# EasyEDA Pro project AS5600无刷电机磁编码器板(兼容 2804_4010无刷电机).epro

# Schematic sch_01
Create Date: 2023-08-28; Page Name: P1; Project Name: 2804电机磁编码器板; Schematic Name: sch_01; Update Date: 2023-08-30; Company: 嘉立创EDA; Page Size: A3; Version: V1.0
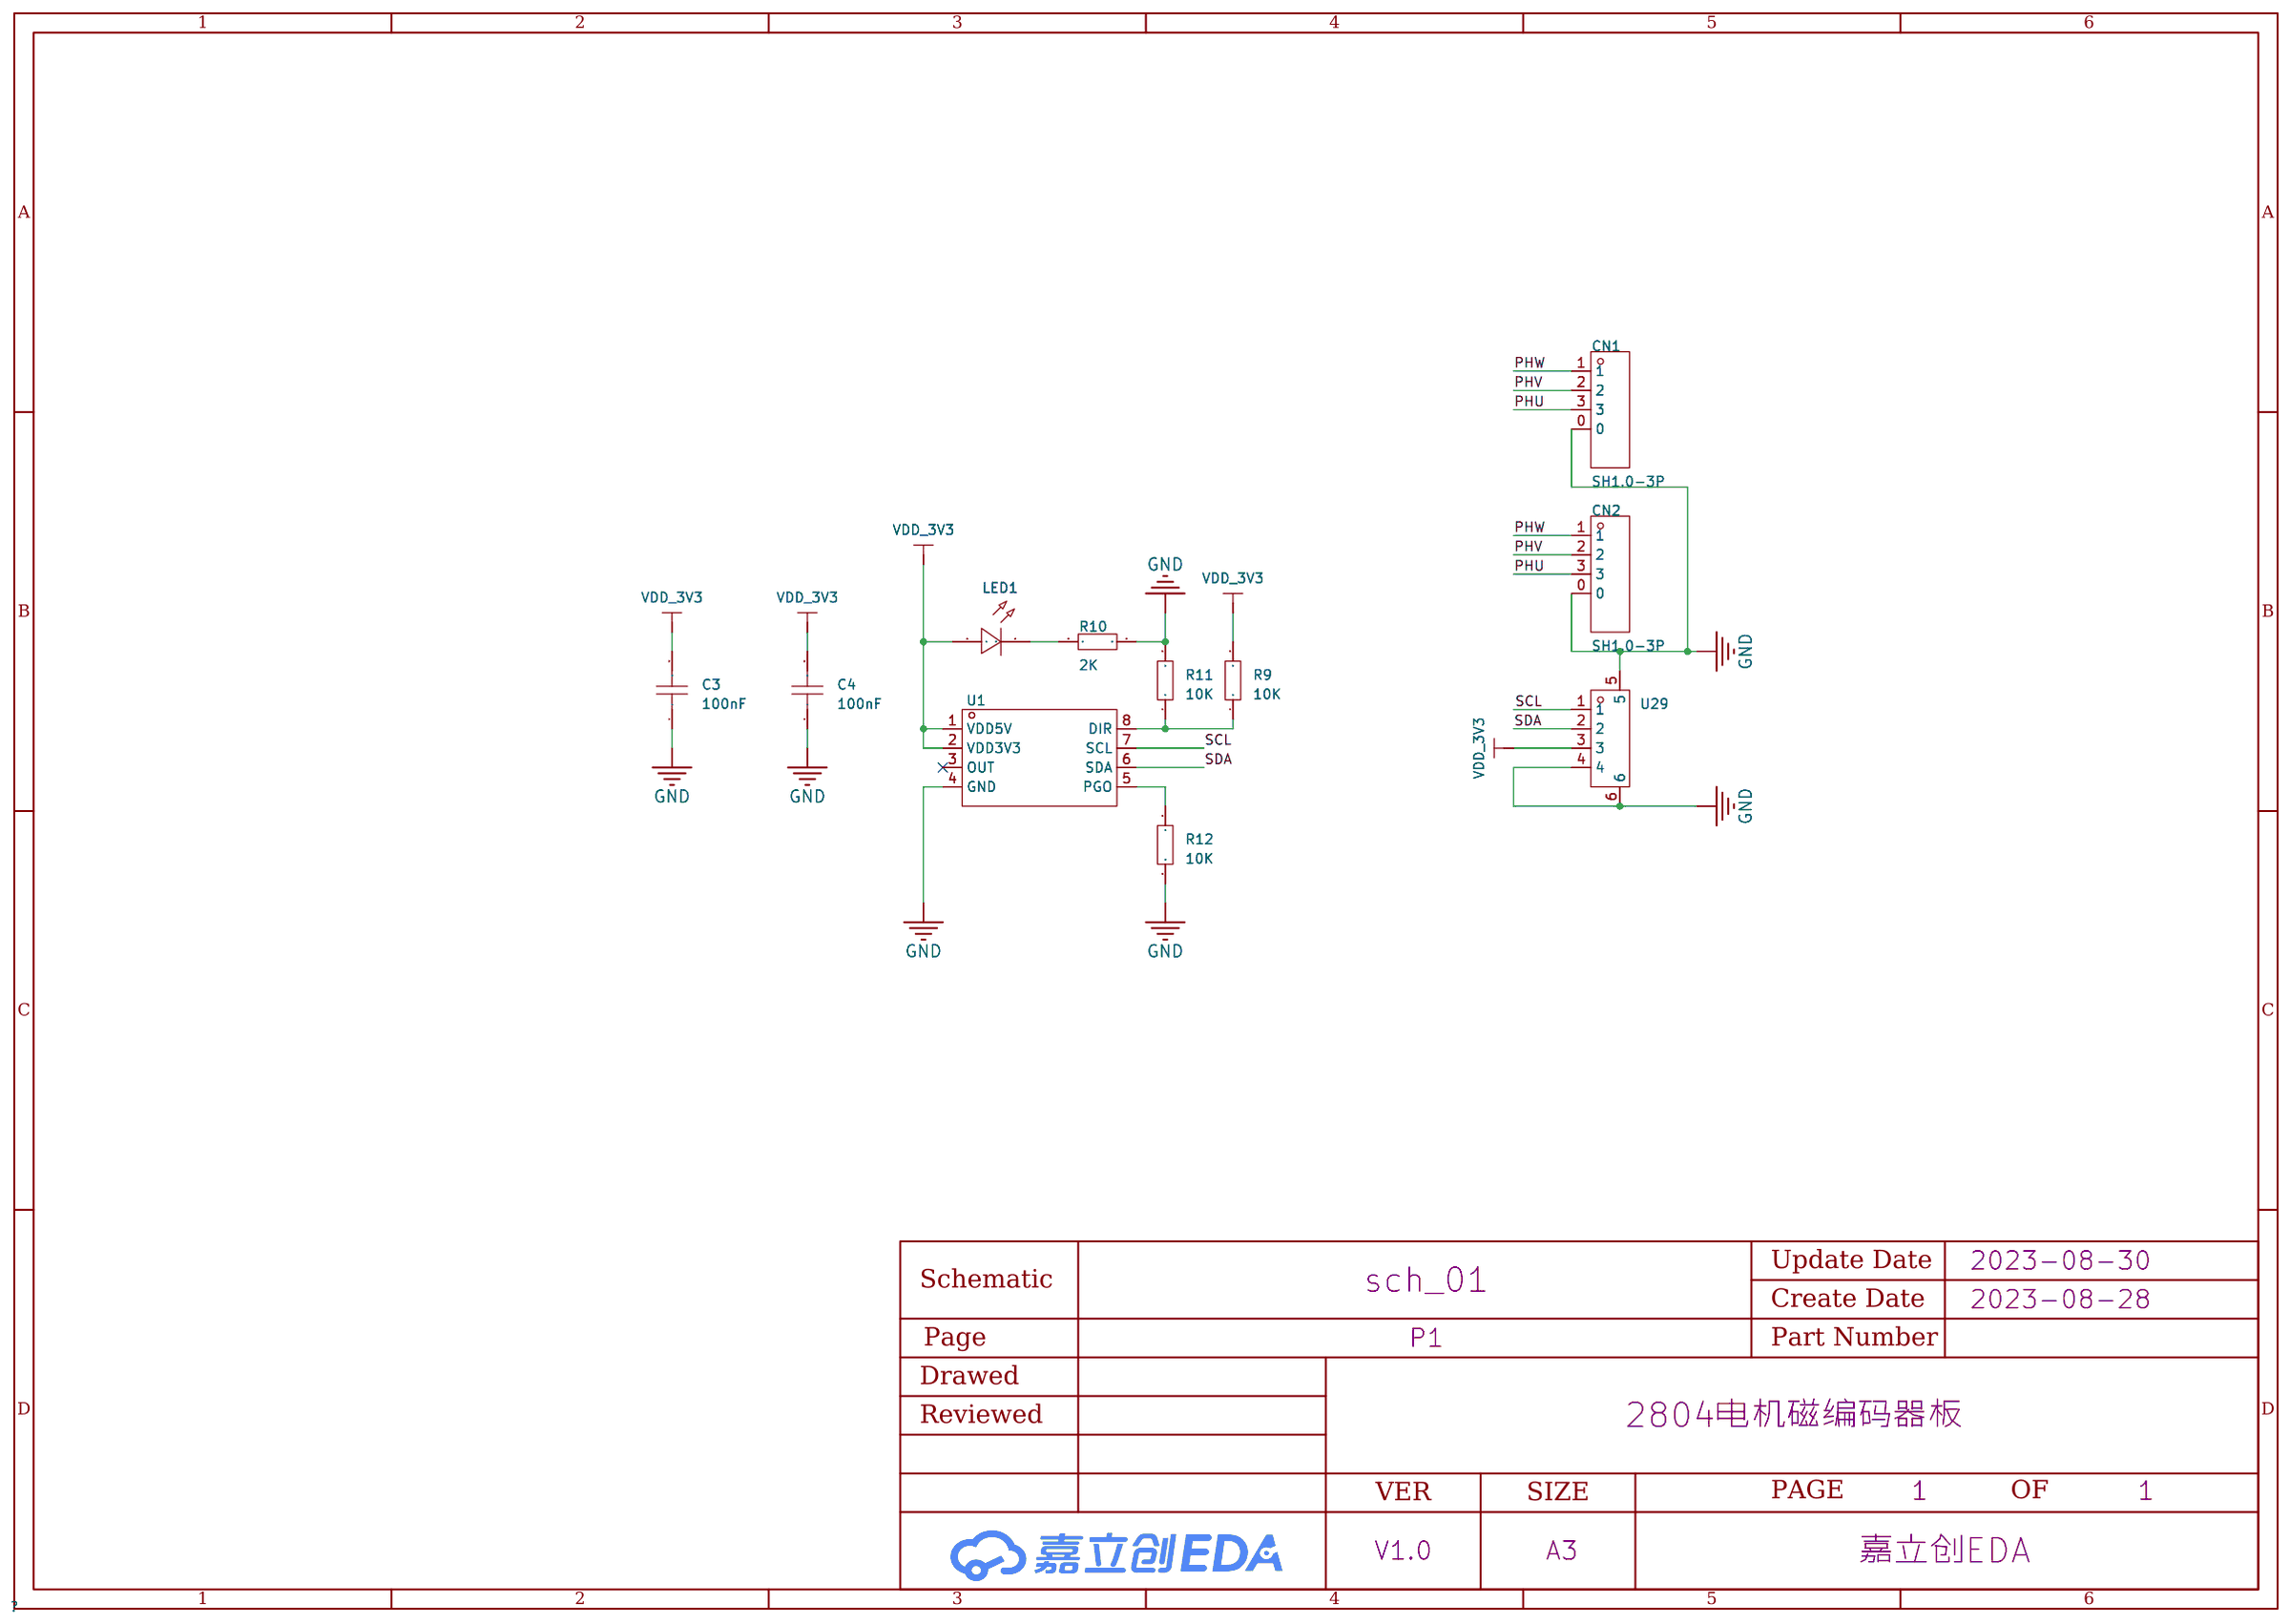
[diagram p0: schematic sheet]

## Parts
C3  100nF  [C0603]
C4  100nF  [C0603]
CN1  SH1.0-3P  [CONN-SMD_3P-P1.00-L5.0-W5.0]
CN2  SH1.0-3P  [CONN-SMD_3P-P1.00-L5.0-W5.0]
LED1  -  [LED_0603]
R9  10K  [R0603]
R10  2K  [R0603]
R11  10K  [R0603]
R12  10K  [R0603]
U1  AS5600-ASOM  [SOIC-8_L5.0-W4.0-P1.27-LS6.0-BL]
U29  SH1.0-4P  [CONN-SMD_4P-P1.00_SH1.0-4P]

## Library data of the parts
C3 C4 = CAP_0603: Supplier Footprint: 0603
CN1 CN2 = SH1.0-3P: Supplier Part: C9900019066; JLCPCB Part Class: 扩展库; Datasheet: https://atta.szlcsc.comnull; Supplier: LCSC
LED1 = LED_0603-G: Supplier Footprint: 0603
R9-R12 = Res_0603: Supplier Footprint: 0603
U1 = AS5600-ASOM: 非接触12bit磁角度位置传感器; Supplier Part: C79815; Manufacturer: ams(艾迈斯半导体); Supplier Footprint: SOIC-8_150mil; JLCPCB Part Class: 扩展库; Datasheet: https://atta.szlcsc.com/upload/public/pdf/source/20161027/1477535527192.pdf; Supplier: LCSC
U29 = SH1.0-4P: Supplier Part: C9900023784; Supplier Footprint: CONN-SMD-4P; JLCPCB Part Class: 扩展库; Supplier: LCSC

## Nets
GND: C3.1 C4.1 CN1.0 CN2.0 R10.1 R11.2 R12.2 U1.4(GND) U29.4 U29.5 U29.6
VDD_3V3: C3.2 C4.2 LED1.2(A) R9.2 U1.1(VDD5V) U1.2(VDD3V3) U29.3
PHU: CN1.3 CN2.3
PHV: CN1.2 CN2.2
PHW: CN1.1 CN2.1
SCL: U1.7(SCL) U29.1
SDA: U1.6(SDA) U29.2
$1N1460: R12.1 U1.5(PGO)
$1N3909: R9.1 R11.1 U1.8(DIR)
Net-(LED1-1): LED1.1(C) R10.2

Not connected (* = marked no-connect by the designer): U1 3(OUT)*

# Schematic sch_02
Create Date: 2023-02-28; Page Name: P1; Project Name: 2804电机磁编码器板; Schematic Name: SCH_02; Update Date: 2023-02-28; Company: 嘉立创EDA; Page Size: A4; Version: V1.0
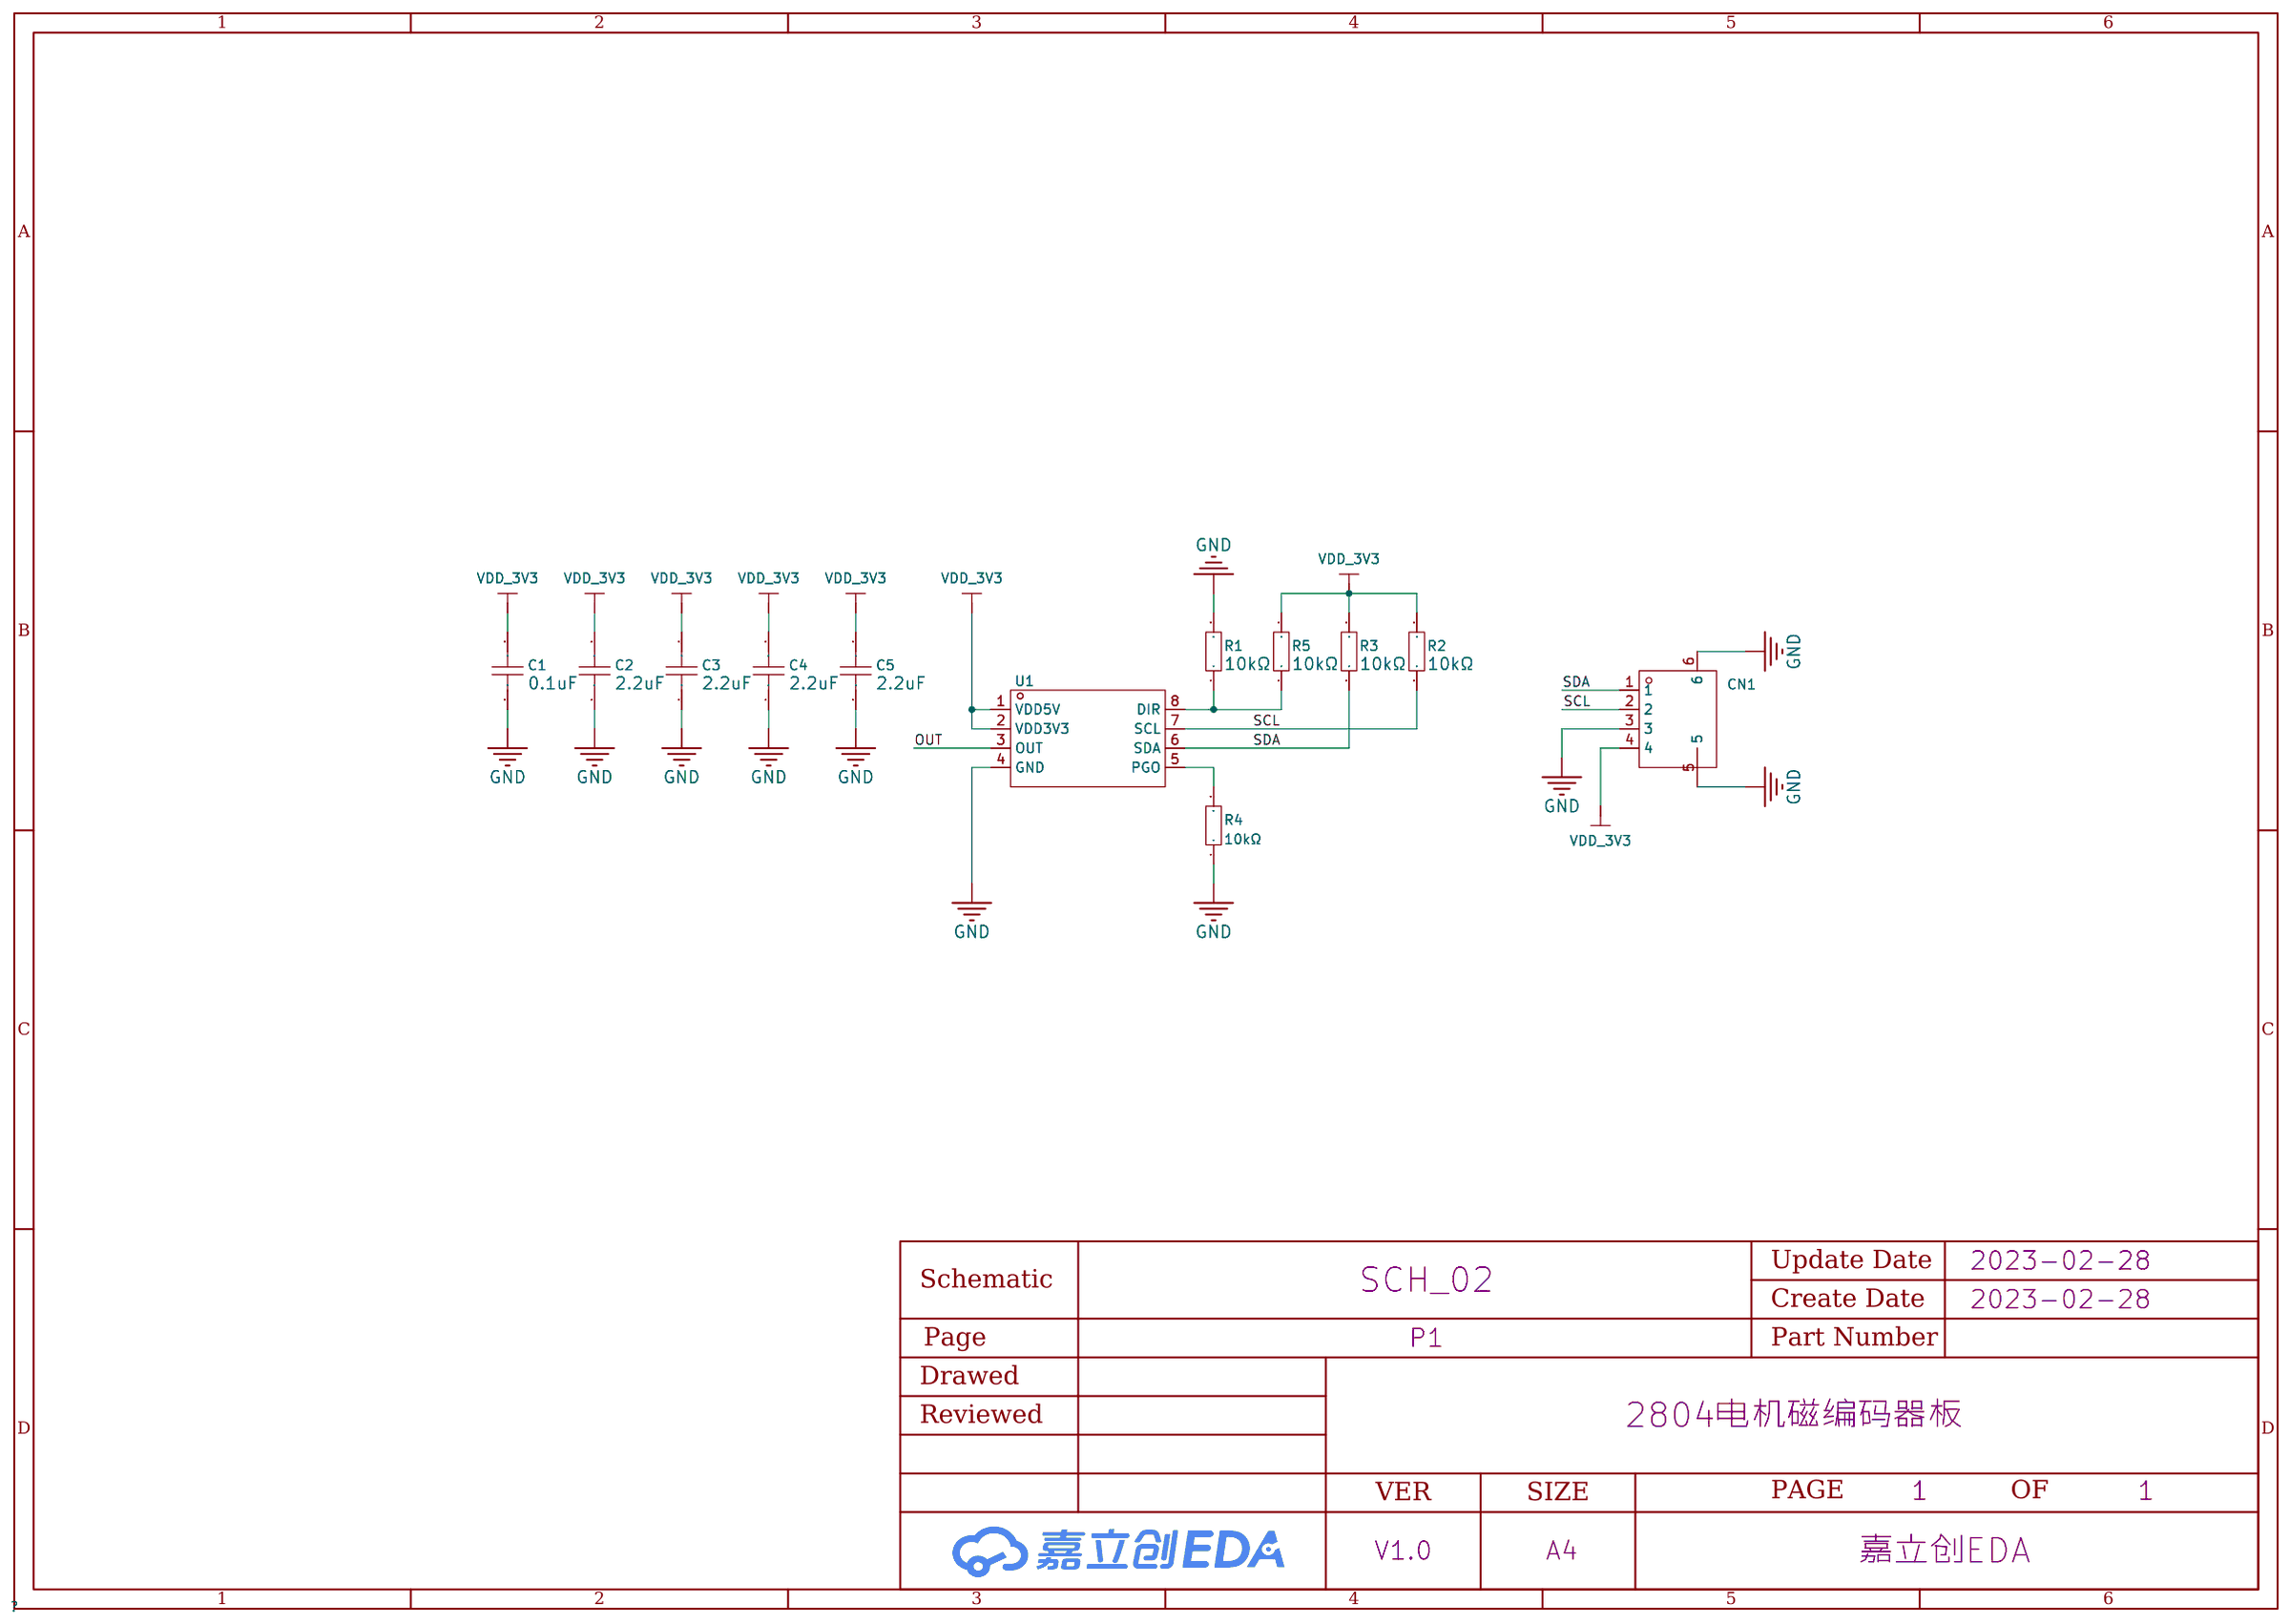
[diagram p1: schematic sheet]

## Parts
C1  0.1uF  [C0603]
C2  2.2uF  [C0603]
C3  2.2uF  [C0603]
C4  2.2uF  [C0603]
C5  2.2uF  [C0603]
CN1  A1257WR-S-4P  [CONN-SMD_A1257WR-S-4P]
R1  10kΩ  [R0603]
R2  10kΩ  [R0603]
R3  10kΩ  [R0603]
R4  10kΩ  [R0603]
R5  10kΩ  [R0603]
U1  AS5600-ASOM  [SOIC-8_L5.0-W4.0-P1.27-LS6.0-BL]

## Library data of the parts
C1 = CL10B104KB8NNNC: 容值:100nF;精度:±10%;额定电压:50V;材质(温度系数):X7R;; LCSC Part Name: 100nF ±10% 50V; Supplier Part: C1591; Manufacturer: SAMSUNG(三星); Supplier Footprint: 0603; JLCPCB Part Class: 扩展库; Datasheet: https://atta.szlcsc.com/upload/public/pdf/source/20160103/1457707680512.pdf; Supplier: LCSC; Tolerance: ±10%; Voltage Rated: 50V; Temperature Coefficient: X7R
C2-C5 = CL10A106MA8NRNC: 容值:10uF;精度:±20%;额定电压:25V;材质(温度系数):X5R;; LCSC Part Name: 10uF ±20% 25V; Supplier Part: C96446; Manufacturer: SAMSUNG(三星); Supplier Footprint: 0603; JLCPCB Part Class: 基础库; Datasheet: https://atta.szlcsc.com/upload/public/pdf/source/20170325/1490427913016.pdf; Supplier: LCSC; Tolerance: ±20%; Voltage Rated: 25V; Temperature Coefficient: X5R
CN1 = A1257WR-S-4P: 参考系列:GH;间距:1.25mm;插针结构:1x4P;排数:1;每排PIN数:4;行距:-;安装方式:-;触头材质:黄铜;; LCSC Part Name: GH1.25卧式贴片 镀锡 4P 针座连接器; Supplier Part: C225127; Manufacturer: CJT(长江连接器); Supplier Footprint: SMD,P=1.25mm; JLCPCB Part Class: Extended Part; Datasheet: https://atta.szlcsc.com/upload/public/pdf/source/20180509/C225127_D8D3C7F8F1F45F960D198B1E232900BE.pdf; Supplier: LCSC; Reference Series: GH; Pitch: 1.25mm; Pins Structure: 1x4P; Number of Rows: 1; Number of PINs Per Row: 4; Contact Material: 黄铜
R1-R3 R5 = 0603WAF1002T5E: 电阻类型:厚膜电阻;阻值:10kΩ;精度:±1%;功率:100mW;温度系数:±100ppm/;最大工作电压:75V;工作温度范围:-55~+155;; LCSC Part Name: 10kΩ ±1% 100mW; Supplier Part: C25804; Manufacturer: UNI-ROYAL(厚声); Supplier Footprint: 0603; JLCPCB Part Class: 基础库; Datasheet: https://atta.szlcsc.com/upload/public/pdf/source/20200306/C422600_1E6D84923E4A46A82E41ADD87F860B5C.pdf; Supplier: LCSC; Type: 厚膜电阻; Tolerance: ±1%; Power(Watts): 100mW; Temperature Coefficient: ±100ppm/; Overload Voltage (Max): 75V; Operating Temperature Range: -55~+155
R4 = 0603WAF1001T5E: LCSC Part Name: 1KΩ(1001) ±1% 编带; Supplier Part: C21190; Manufacturer: UNI-ROYAL(厚声); Supplier Footprint: 0603; JLCPCB Part Class: 基础库; Datasheet: https://atta.szlcsc.com/upload/public/pdf/source/20170920/C21190_1505887441885980538.pdf; Supplier: LCSC
U1 = AS5600-ASOM: 非接触12bit磁角度位置传感器; Supplier Part: C79815; Manufacturer: ams(艾迈斯半导体); Supplier Footprint: SOIC-8_150mil; JLCPCB Part Class: 扩展库; Datasheet: https://atta.szlcsc.com/upload/public/pdf/source/20161027/1477535527192.pdf; Supplier: LCSC

## Nets
GND: C1.1 C2.1 C3.1 C4.1 C5.1 CN1.3 CN1.5 CN1.6 R1.2 R4.1 U1.4(GND)
VDD_3V3: C1.2 C2.2 C3.2 C4.2 C5.2 CN1.4 R2.2 R3.2 R5.2 U1.1(VDD5V) U1.2(VDD3V3)
OUT: U1.3(OUT)
SCL: CN1.2 R2.1 U1.7(SCL)
SDA: CN1.1 R3.1 U1.6(SDA)
$1N622: R1.1 R5.1 U1.8(DIR)
$1N626: R4.2 U1.5(PGO)

# Board PCB_01
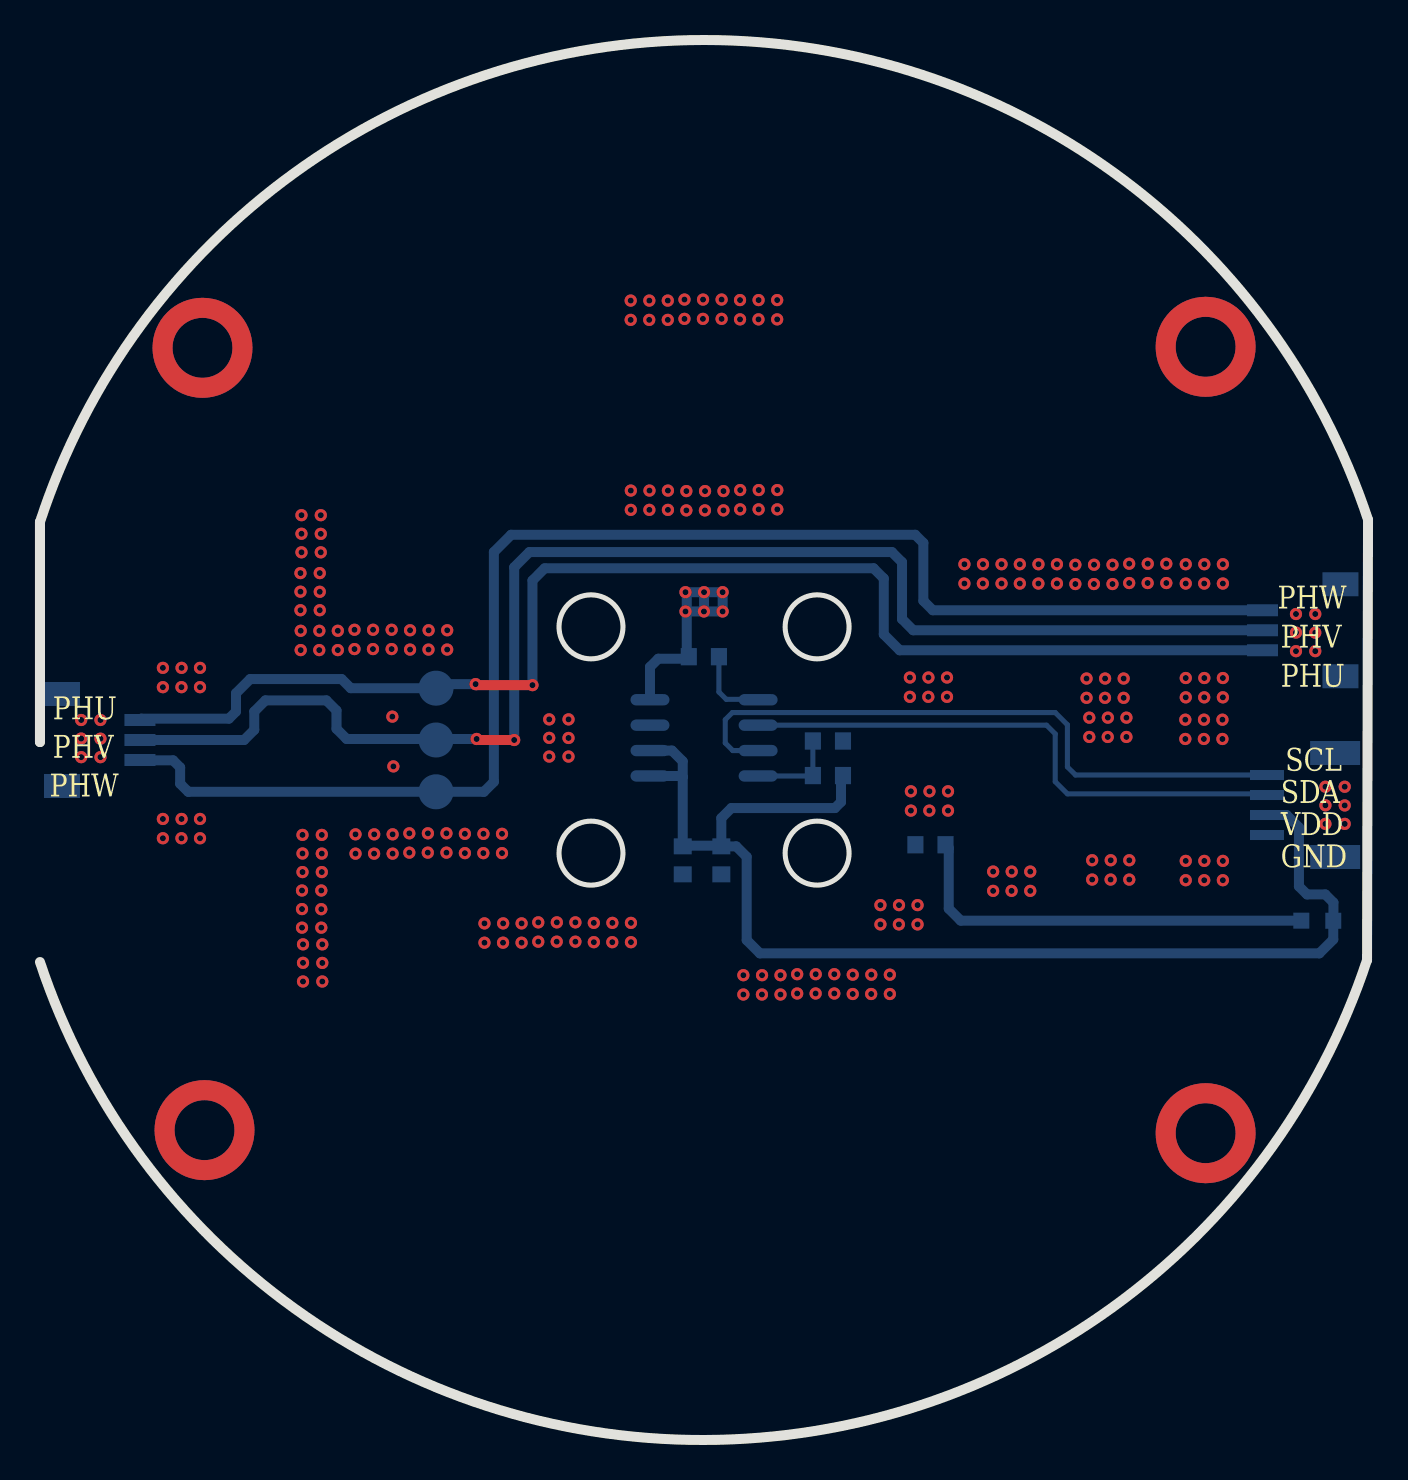
[diagram p2: board, top side]
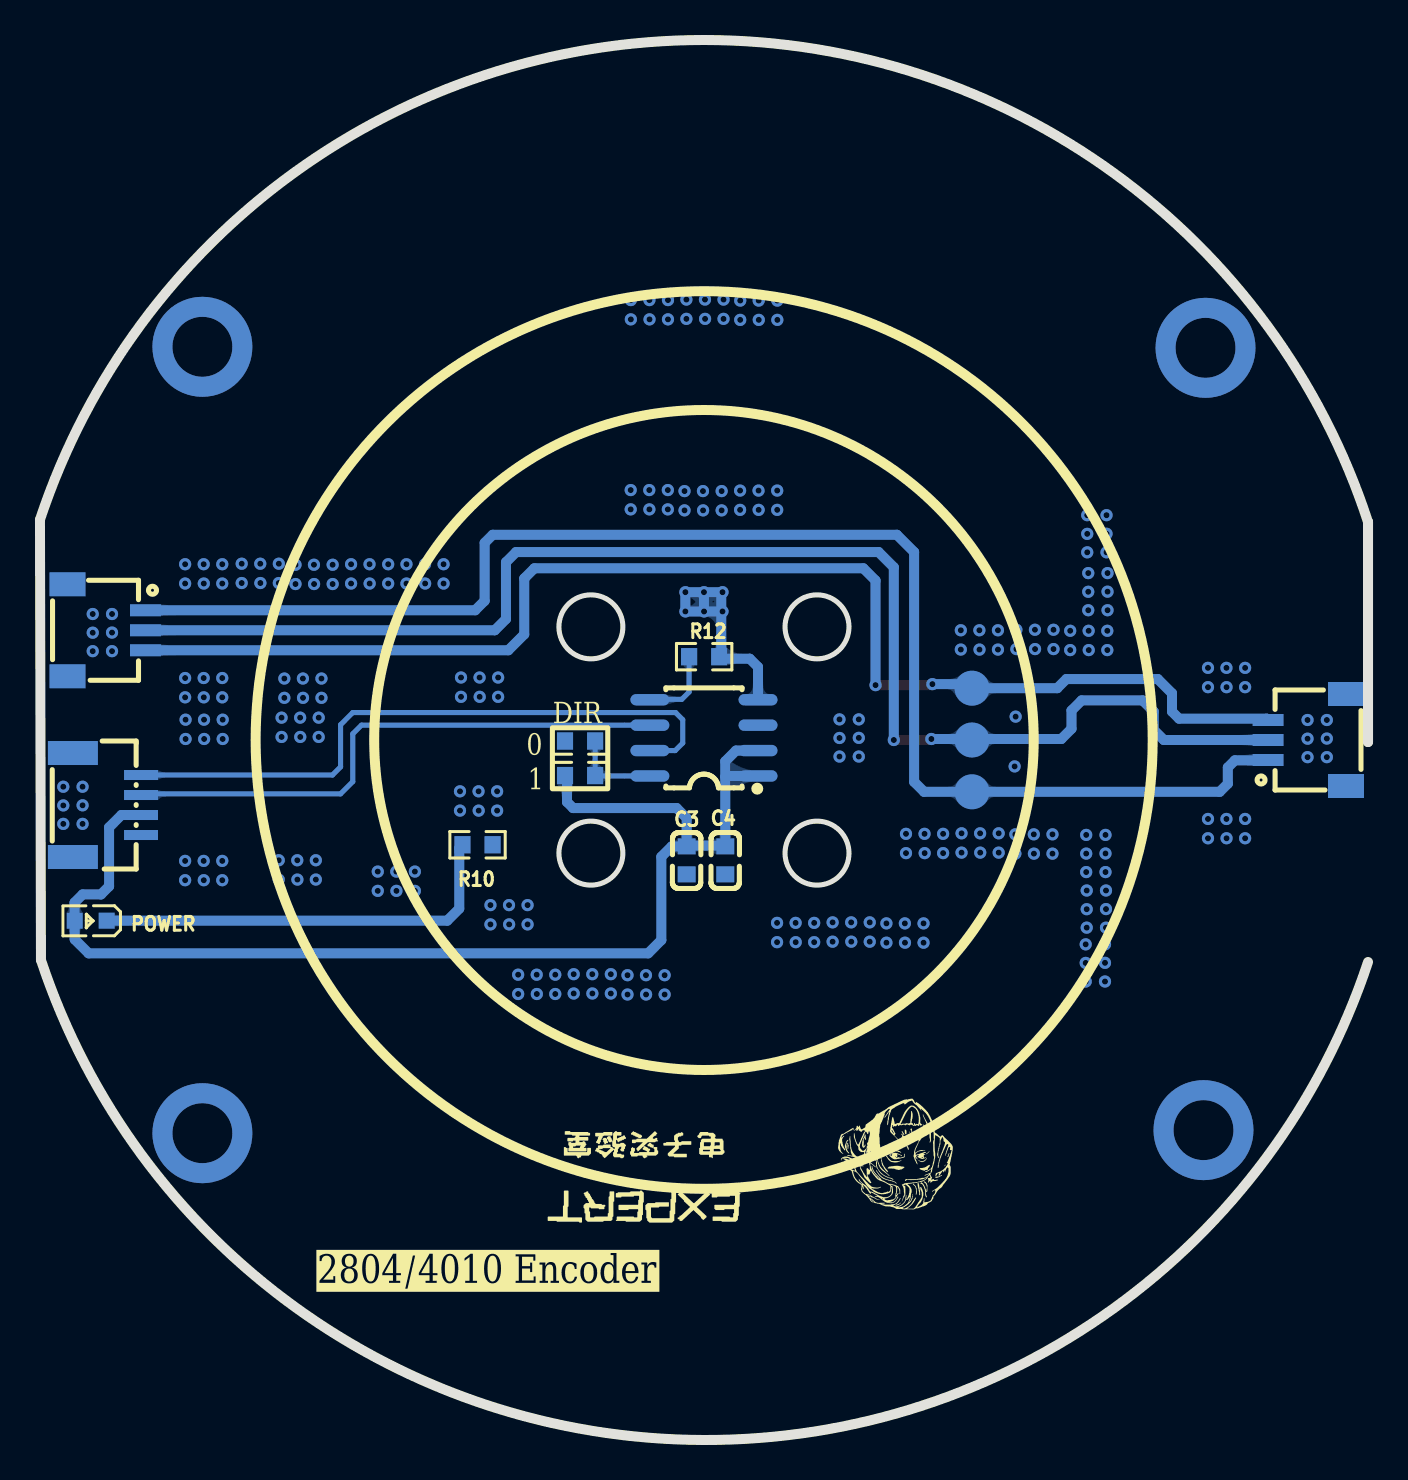
[diagram p3: board, bottom side, seen from below]

Outline 66.45 x 70 mm; copper layers: Top Layer, Bottom Layer. Coordinates in mm from the lower left corner of the outline.
Outline path: circle c27.57,40.66 r1.6 ; circle c27.57,29.34 r1.6 ; circle c38.88,40.66 r1.6 ; circle c38.88,29.34 r1.6 ; 0,45.9 0,34.9 0,45.9 ; 0,45.9 arc(12.71,63.34) 33.23,70 arc(53.71,63.38) 66.45,46.02 66.4,24 arc(53.69,6.65) 33.23,0 arc(12.74,6.57) 0,23.9
Stack: Top Layer 0.035mm / Dielectric1 1.51mm FR4 er 4.5 / Bottom Layer 0.035mm

## Design rules (mm)
template: 用户自定义配置
spacing safeClearance (default): track to track 0.152, other pairs 0 to 0.3
track width trackWidth (default): min 0.127, default 0.254, max 2.54
differential pair differentialPair (default): width min 0.127, default 0.254, max 2.54; gap min 0.152, default 0.152
via viaSize (default): diameter min 0.5, default 0.61, max 10; hole min 0.3, default 0.305, max 5.999

## Placement (name value [footprint] x y rotation side)
C3  100nF  [C0603]  34.09 28.98 90 bottom
C4  100nF  [C0603]  32.16 28.98 90 bottom
CN1  SH1.0-3P  [CONN-SMD_3P-P1.00-L5.0-W5.0]  63.12 40.49 270 bottom
CN2  SH1.0-3P  [CONN-SMD_3P-P1.00-L5.0-W5.0]  3.05 35 90 bottom
NOREF  -  [Pad_e1105]  19.82 37.59 180 top
NOREF#2  -  [Pad_e1112]  19.82 35 180 top
NOREF#3  -  [Pad_e1113]  19.82 32.41 180 top
POWER  -  [LED_0603]  63.96 25.96 0 bottom
R9  10K  [R0603]  39.42 33.22 0 bottom
R10  2K  [R0603]  44.56 29.76 0 bottom
R11  10K  [R0603]  39.42 34.95 0 bottom
R12  10K  [R0603]  33.22 39.17 180 bottom
U1  AS5600-ASOM  [SOIC-8_L5.0-W4.0-P1.27-LS6.0-BL]  33.23 35.11 90 bottom
U29  SH1.0-4P  [CONN-SMD_4P-P1.00_SH1.0-4P]  63.1 31.75 270 bottom

## Footprints (pads in the part's own frame, mm; a bottom-side part is the same pattern mirrored in y, then rotated)
C0603
  rect 0.8x0.9 smd: 1(-0.7,0) 2(0.7,0)
CONN-SMD_3P-P1.00-L5.0-W5.0
  rect 1.2x1.8 smd: 0(-2.3,-1.95) 0(2.3,-1.95)
  rect 0.6x1.55 smd: 1(-1,1.95) 2(0,1.95) 3(1,1.95)
CONN-SMD_4P-P1.00_SH1.0-4P
  rect 0.5x1.7 smd: 1(-1.5,1.705) 2(-0.5,1.705) 3(0.5,1.705) 4(1.5,1.705)
  rect 1.2x2.5 smd: 5(-2.6,-1.705) 6(2.6,-1.705)
LED_0603
  rect 0.8x0.8 smd: 1(-0.851,-0.01) 2(0.75,-0.005)
Pad_e1105
  round 1.75 smd far side: 1(0,0)
Pad_e1112
  round 1.75 smd far side: 1(0,0)
Pad_e1113
  round 1.75 smd far side: 1(0,0)
R0603
  rect 0.806x0.864 smd: 1(-0.753,0) 2(0.753,0)
SOIC-8_L5.0-W4.0-P1.27-LS6.0-BL
  oval 0.569x1.95 smd: 1(-1.905,-2.705) 2(-0.635,-2.705) 3(0.635,-2.705) 4(1.905,-2.705) 5(1.905,2.705) 6(0.635,2.705) 7(-0.635,2.705) 8(-1.905,2.705)

## Nets
GND: C3.1 C4.1 CN1.0 CN2.0 R10.1 R11.2 R12.2 U1.4 U29.4 U29.5 U29.6
VDD_3V3: C3.2 C4.2 POWER.2 R9.2 U1.1 U1.2 U29.3
PHU: CN1.3 CN2.3 NOREF.1
PHV: CN1.2 CN2.2 NOREF#2.1
PHW: CN1.1 CN2.1 NOREF#3.1
SCL: U1.7 U29.1
SDA: U1.6 U29.2
$1N1460: R12.1 U1.5
$1N3909: R9.1 R11.1 U1.8
$1N7213: POWER.1 R10.2

Pads without a net: U1 3

## Via types
v1: diameter 5, hole 3, Top Layer to Bottom Layer, 4 vias
v2: diameter 0.61, hole 0.305, Top Layer to Bottom Layer, 276 vias

## Routing (per net, layer and track width the routed paths; a pad name or vN(x,y) marks a point on that pad's centre or on a via; arc(x,y) is an arc through that point)
GND: length 12.8
  Bottom Layer w0.5: 32.36,39.06 30.94,39.06 30.52,38.65 U1.4 ; 32.36,39.06 R12.2 ; 32.36,39.06 32.36,41.43 ; v2(33.23,42.39) v2(32.3,42.39) 32.36,42.33 32.36,41.43 ; v2(33.23,42.39) 33.23,41.43 v2(33.22,41.43) ; v2(33.23,42.39) v2(34.16,42.39) v2(34.16,41.43) v2(33.22,41.43) ; v2(33.22,41.43) 32.36,41.43 ; 32.36,41.43 v2(32.3,41.43)
  vias: v2(2.06,36) v2(2.06,35.07) v2(2.06,34.14) v2(3.03,36) v2(3.03,35.07) v2(3.03,34.14) v2(6.15,38.61) v2(6.15,37.64) v2(6.15,31.05) v2(6.15,30.09) v2(7.08,38.61) v2(7.08,37.64) v2(7.08,31.05) v2(7.08,30.09) v2(8.01,38.61) v2(8.01,37.64) v2(8.01,31.05) v2(8.01,30.09) v2(13.03,43.35) v2(13.03,42.42) v2(13.03,41.49) v2(13.05,40.46) v2(13.05,39.5) v2(13.08,46.24) v2(13.08,45.31) v2(13.08,44.38) v2(13.14,30.25) v2(13.14,29.33) v2(13.14,28.4) v2(13.11,27.47) v2(13.11,26.55) v2(13.11,25.62) v2(13.16,24.78) v2(13.16,23.86) v2(13.16,22.92) v2(14.05,46.24) v2(14.05,45.31) v2(14.05,44.38) v2(14,43.35) v2(14,42.41) v2(14,41.49) v2(13.98,40.46) v2(13.97,39.5) v2(14.1,30.25) v2(14.1,29.32) v2(14.1,28.4) v2(14.08,27.47) v2(14.08,26.54) v2(14.08,25.62) v2(14.13,24.78) v2(14.13,23.85) v2(14.13,22.92) v2(14.9,40.46) v2(14.9,39.5) v2(15.74,40.51) v2(15.74,39.55) v2(15.79,30.28) v2(15.79,29.32) v2(16.67,40.51) v2(16.66,39.55) v2(16.72,30.28) v2(16.72,29.32) v2(17.59,40.51) v2(17.59,39.55) v2(17.63,36.17) v2(17.65,30.28) v2(17.65,29.32) v2(17.68,33.68) v2(18.52,40.49) v2(18.52,39.52) v2(18.48,30.33) v2(18.48,29.37) v2(19.45,40.49) v2(19.44,39.52) v2(19.41,30.33) v2(19.4,29.37) v2(20.34,30.33) v2(20.34,29.37) v2(20.37,40.49) v2(20.37,39.52) v2(21.26,30.31) v2(21.26,29.34) v2(22.19,30.31) v2(22.18,29.34) v2(22.24,25.83) v2(22.24,24.87) v2(23.12,30.31) v2(23.12,29.34) v2(23.17,24.87) v2(23.17,25.83) v2(24.1,25.83) v2(24.1,24.87) v2(24.93,25.88) v2(24.93,24.92) v2(25.48,36.03) v2(25.48,35.11) v2(25.48,34.17) v2(25.86,25.88) v2(25.85,24.92) v2(26.44,36.03) v2(26.44,35.1) v2(26.44,34.17) v2(26.79,25.88) v2(26.79,24.92) v2(27.71,25.86) v2(27.71,24.89) v2(28.64,25.86) v2(28.63,24.89) v2(29.56,56.97) v2(29.56,56.01) v2(29.56,47.47) v2(29.56,46.51) v2(29.57,25.86) v2(29.57,24.89) v2(30.49,56.97) v2(30.48,56.01) v2(30.5,47.47) v2(30.49,46.51) v2(31.41,56.97) v2(31.41,56.01) v2(31.42,47.47) v2(31.42,46.51) v2(32.25,57.02) v2(32.25,56.06) v2(32.34,47.45) v2(32.34,46.48) v2(33.17,56.06) v2(33.18,57.02) v2(33.27,46.48) v2(33.28,47.45) v2(34.1,57.02) v2(34.1,56.06) v2(34.2,47.45) v2(34.2,46.48) v2(35.03,57) v2(35.03,56.03) v2(35.03,47.5) v2(35.03,46.53) v2(35.19,23.24) v2(35.19,22.27) v2(35.96,57) v2(35.95,56.03) v2(35.96,47.5) v2(35.96,46.53) v2(36.13,23.24) v2(36.12,22.27) v2(36.88,57) v2(36.88,56.03) v2(36.89,47.5) v2(36.89,46.53) v2(37.05,23.24) v2(37.05,22.27) v2(37.89,23.29) v2(37.89,22.33) v2(38.81,23.29) v2(38.81,22.33) v2(39.74,23.29) v2(39.74,22.33) v2(40.67,23.27) v2(40.67,22.3) v2(41.59,23.27) v2(41.59,22.3) v2(42.05,26.75) v2(42.05,25.78) v2(42.52,23.27) v2(42.52,22.3) v2(42.98,26.75) v2(42.97,25.78) v2(43.53,38.12) v2(43.53,37.16) v2(43.58,32.43) v2(43.58,31.47) v2(43.91,26.75) v2(43.91,25.78) v2(44.45,38.12) v2(44.45,37.16) v2(44.5,32.43) v2(44.5,31.47) v2(45.38,38.12) v2(45.38,37.16) v2(45.43,32.43) v2(45.43,31.47) v2(46.25,43.79) v2(46.25,42.82) v2(47.18,43.79) v2(47.18,42.82) v2(47.69,28.42) v2(47.69,27.46) v2(48.11,43.79) v2(48.11,42.82) v2(48.62,28.42) v2(48.61,27.46) v2(49.03,43.79) v2(49.03,42.82) v2(49.55,28.42) v2(49.55,27.46) v2(49.96,43.79) v2(49.95,42.82) v2(50.88,43.79) v2(50.88,42.82) v2(51.81,43.76) v2(51.81,42.8) v2(52.36,38.07) v2(52.36,37.11) v2(52.5,36.12) v2(52.5,35.15) v2(52.65,28.99) v2(52.65,28.02) v2(52.74,43.76) v2(52.73,42.8) v2(53.29,38.07) v2(53.29,37.11) v2(53.43,36.12) v2(53.43,35.15) v2(53.57,28.02) v2(53.66,43.76) v2(53.66,42.8) v2(53.57,28.99) v2(54.22,38.07) v2(54.22,37.11) v2(54.36,36.12) v2(54.36,35.15) v2(54.5,43.81) v2(54.5,42.85) v2(54.5,28.99) v2(54.5,28.02) v2(55.43,43.81) v2(55.42,42.85) v2(56.35,43.81) v2(56.35,42.85) v2(57.33,43.79) v2(57.33,42.82) v2(57.33,38.1) v2(57.33,37.13) v2(57.31,36.02) v2(57.31,35.05) v2(57.33,28.95) v2(57.33,27.99) v2(58.26,43.79) v2(58.25,42.82) v2(58.26,38.1) v2(58.25,37.13) v2(58.24,36.02) v2(58.23,35.05) v2(58.26,28.95) v2(58.25,27.99) v2(59.16,36.02) v2(59.16,35.05) v2(59.19,43.79) v2(59.19,42.82) v2(59.19,38.1) v2(59.19,37.13) v2(59.19,28.95) v2(59.19,27.99) v2(62.84,41.3) v2(62.84,40.37) v2(62.84,39.44) v2(63.81,41.3) v2(63.81,40.36) v2(63.81,39.44) v2(64.32,32.66) v2(64.32,31.73) v2(64.32,30.81) v2(65.28,32.66) v2(65.28,31.73) v2(65.28,30.81)
VDD_3V3: length 63.1
  Bottom Layer w0.5: 34.09,29.72 C3.2 34.84,29.68 35.36,29.16 35.36,24.99 36.02,24.33 64.01,24.33 64.71,25.03 64.71,25.96 64.72,25.97 64.72,26.87 64.31,27.28 63.4,27.28 62.99,27.69 62.99,30.63 62.37,31.25 U29.3 ; 34.09,29.72 32.2,29.72 C4.2 32.16,33.15 ; 34.09,29.72 34.09,31.09 34.59,31.6 39.77,31.6 40.08,31.9 40.08,33.12 R9.2 ; 32.16,33.15 32.11,33.2 U1.1 ; 32.16,33.15 32.16,33.93 31.62,34.47 U1.2
(no net):
  vias: v1(8.13,54.61) v1(8.23,15.49) v1(58.32,54.66) v1(58.32,15.34)
PHU: length 66.7
  Top Layer w0.5: v2(21.8,37.79) 21.85,37.74 v2(24.64,37.74)
  Bottom Layer w0.5: v2(24.64,37.74) 24.64,42.98 25.25,43.59 41.71,43.59 42.22,43.08 42.22,40.28 43.02,39.49 CN1.3 ; CN2.3 5.07,36.07 9.45,36.07 9.81,36.42 9.81,37.34 10.52,38.05 15.09,38.05 15.55,37.59 NOREF.1 20.02,37.79 v2(21.8,37.79)
PHV: length 71.2
  Top Layer w0.5: v2(21.85,35.05) 21.9,35 v2(23.73,35)
  Bottom Layer w0.5: 19.87,35.05 NOREF#2.1 ; 19.87,35.05 15.34,35.05 14.84,35.56 14.84,36.47 14.33,36.98 11.28,36.98 10.72,36.42 10.72,35.51 10.21,35 CN2.2 ; 19.87,35.05 v2(21.85,35.05) ; v2(23.73,35) 23.73,43.64 24.49,44.4 42.62,44.4 43.13,43.89 43.13,41.05 43.69,40.49 CN1.2
PHW: length 72.6
  Bottom Layer w0.5: CN2.1 5.02,33.98 6.66,33.98 7.01,33.63 7.01,32.82 7.42,32.41 NOREF#3.1 22.21,32.41 22.71,32.91 22.71,44.4 23.57,45.26 43.79,45.26 44.2,44.86 44.2,41.96 44.67,41.49 CN1.1
SCL: length 32.7
  Bottom Layer w0.254: U29.1 51.81,33.25 51.41,33.66 51.41,35.76 50.8,36.37 34.64,36.37 34.29,36.02 34.29,34.85 34.66,34.47 35.93,34.47
SDA: length 28.3
  Bottom Layer w0.254: 35.93,35.74 50.36,35.74 50.8,35.31 50.8,32.92 51.41,32.31 61.33,32.31 U29.2
$1N1460: length 3.9
  Bottom Layer w0.254: 35.93,37.01 35.91,37.03 34.34,37.03 33.97,37.4 R12.1
$1N3909: length 4.5
  Bottom Layer w0.254: 35.93,33.2 38.65,33.2 R9.1 R11.1
$1N7213: length 21.1
  Bottom Layer w0.5: POWER.1 46.07,25.97 45.47,26.57 45.47,29.6 R10.2

## Copper pours and planes (outline as drawn; the poured copper is in the pictures)
GND on Top Layer: -4.27,72.08 69.34,72.08 69.34,-4.12 -4.27,-4.12
GND on Bottom Layer: -5.44,73.66 71.12,73.66 71.12,-5.69 -5.44,-5.69

Small or netless copper shapes (teardrops, artwork), in the pictures only: 43 on Bottom Layer

## Text on the board
Bottom Silkscreen Layer: DIR | 1 | 0 | 2804/4010 Encoder
Top Silkscreen Layer: GND | SDA | VDD | SCL | PHW | PHV | PHU

# Board PCB_02
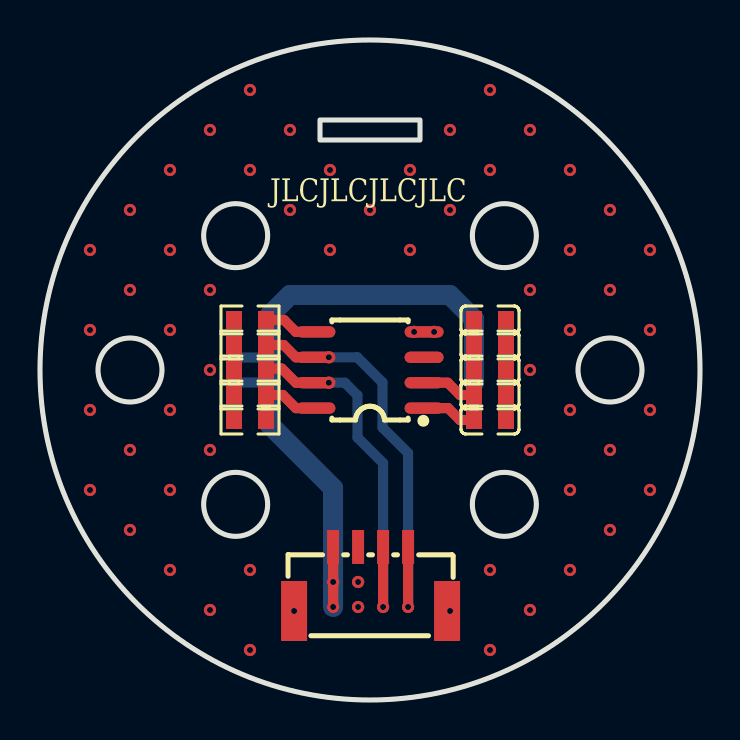
[diagram p4: board, top side]
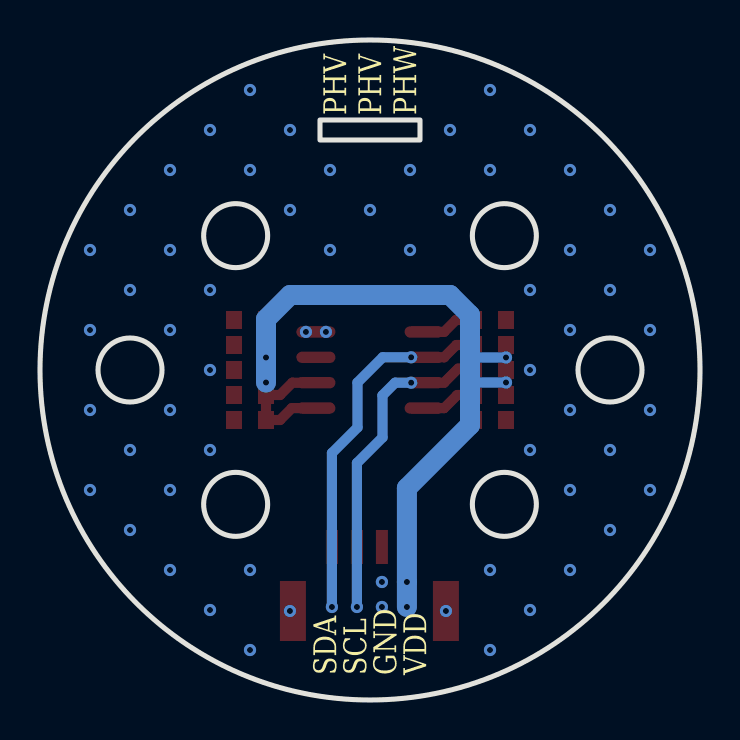
[diagram p5: board, bottom side, seen from below]

Outline 33 x 33 mm; copper layers: Top Layer, Bottom Layer. Coordinates in mm from the lower left corner of the outline.
Outline path: circle c4.5,16.5 r1.6 ; circle c9.78,23.22 r1.6 ; circle c9.78,9.78 r1.6 ; rectangle 14,29 19,28 ; circle c16.5,16.5 r16.5 ; circle c23.22,23.22 r1.6 ; circle c23.22,9.78 r1.6 ; circle c28.5,16.5 r1.6
Stack: Top Layer 0.035mm / Dielectric1 1.51mm FR4 er 4.5 / Bottom Layer 0.035mm

## Design rules (mm)
template: 自定义配置
spacing copperThickness1oz (default): track to track 0.102, other pairs 0 to 0.3
spacing copperThickness2oz: track to track 0.203, other pairs 0.152 to 0.3
track width copperThickness1oz (default): min 0.127, default 0.254, max 2.54
track width copperThickness2oz: min 0.203, default 0.254, max 2.54
differential pair differentialPair (default): width min 0.127, default 0.254, max 2.54; gap min 0.152, default 0.152
via viaSize (default): diameter min 0.5, default 0.61, max 10; hole min 0.3, default 0.305, max 6.3

## Placement (name value [footprint] x y rotation side)
C1  0.1uF  [C0603]  22.5 16.5 180 top
C2  2.2uF  [C0603]  22.5 17.75 180 top
C3  2.2uF  [C0603]  22.5 15.25 180 top
C4  2.2uF  [C0603]  22.5 14 180 top
C5  2.2uF  [C0603]  22.5 19 180 top
CN1  A1257WR-S-4P  [CONN-SMD_A1257WR-S-4P]  16.53 6.05 0 top
R1  10kΩ  [R0603]  10.5 14 180 top
R2  10kΩ  [R0603]  10.5 16.5 180 top
R3  10kΩ  [R0603]  10.5 17.75 180 top
R4  10kΩ  [R0603]  10.5 19 0 top
R5  10kΩ  [R0603]  10.5 15.25 180 top
U1  AS5600-ASOM  [SOIC-8_L5.0-W4.0-P1.27-LS6.0-BL]  16.5 16.5 90 top

## Footprints (pads in the part's own frame, mm; a bottom-side part is the same pattern mirrored in y, then rotated)
C0603
  rect 0.8x0.9 smd: 1(-0.8,0) 2(0.8,0)
CONN-SMD_A1257WR-S-4P
  rect 0.6x1.7 smd: 1(1.875,1.6) 2(0.625,1.6) 3(-0.625,1.6) 4(-1.875,1.6)
  rect 1.3x3 smd: 5(3.825,-1.6) 6(-3.825,-1.6)
R0603
  rect 0.8x0.9 smd: 1(-0.8,0) 2(0.8,0)
SOIC-8_L5.0-W4.0-P1.27-LS6.0-BL
  oval 0.569x1.95 smd: 1(-1.905,-2.705) 2(-0.635,-2.705) 3(0.635,-2.705) 4(1.905,-2.705) 5(1.905,2.705) 6(0.635,2.705) 7(-0.635,2.705) 8(-1.905,2.705)

## Nets
As in the schematic.

## Via types
v1: diameter 0.61, hole 0.305, Top Layer to Bottom Layer, 71 vias

## Routing (per net, layer and track width the routed paths; a pad name or vN(x,y) marks a point on that pad's centre or on a via; arc(x,y) is an arc through that point)
GND:
  vias: v1(2.5,22.5) v1(2.5,18.5) v1(2.5,14.5) v1(2.5,10.5) v1(4.5,24.5) v1(4.5,20.5) v1(4.5,12.5) v1(4.5,8.5) v1(6.5,26.5) v1(6.5,22.5) v1(6.5,18.5) v1(6.5,14.5) v1(6.5,10.5) v1(6.5,6.5) v1(8.5,28.5) v1(8.5,20.5) v1(8.5,16.5) v1(8.5,12.5) v1(8.5,4.5) v1(10.5,30.5) v1(10.5,26.5) v1(10.5,6.5) v1(10.5,2.5) v1(12.5,28.5) v1(12.5,24.5) v1(12.7,4.45) v1(14.5,26.5) v1(14.5,22.5) v1(15.9,5.9) v1(15.9,4.65) v1(16.5,24.5) v1(18.5,26.5) v1(18.5,22.5) v1(18.71,18.41) v1(19.71,18.41) v1(20.5,28.5) v1(20.5,24.5) v1(20.5,4.45) v1(22.5,30.5) v1(22.5,26.5) v1(22.5,6.5) v1(22.5,2.5) v1(24.5,28.5) v1(24.5,20.5) v1(24.5,16.5) v1(24.5,12.5) v1(24.5,4.5) v1(26.5,26.5) v1(26.5,22.5) v1(26.5,18.5) v1(26.5,14.5) v1(26.5,10.5) v1(26.5,6.5) v1(28.5,24.5) v1(28.5,20.5) v1(28.5,12.5) v1(28.5,8.5) v1(30.5,22.5) v1(30.5,18.5) v1(30.5,14.5) v1(30.5,10.5)
VDD_3V3: length 49.8
  Top Layer w0.508: R5.2 v1(9.7,15.88) R2.2 v1(9.7,17.12) R3.2 ; U1.2 20.38,15.86 21,15.25 C3.2 ; v1(14.66,4.65) v1(14.66,5.9) CN1.4 ; C3.2 C4.2 21,14 20.41,14.59 U1.1 ; C3.2 v1(21.7,15.88) C1.2 v1(21.7,17.12) C2.2 C5.2
  Bottom Layer w0.508: v1(9.7,15.88) 11.5,15.88 ; v1(9.7,17.12) 11.5,17.12
  Bottom Layer w1: v1(21.7,15.88) v1(21.7,17.12) 21.7,19.04 20.49,20.25 12.5,20.25 11.5,19.25 11.5,13.75 14.66,10.59 v1(14.66,5.9) v1(14.66,4.65)
SCL: length 18.6
  Top Layer w0.508: CN1.2 v1(17.15,4.65) ; R2.1 11.37,16.57 12.09,16.57 12.79,15.86 U1.7
  Bottom Layer w0.508: v1(14.44,15.86) 15.24,15.86 15.88,15.23 15.88,13.12 17.15,11.85 v1(17.15,4.65)
SDA: length 20.7
  Top Layer w0.508: U1.6 12.79,17.14 12.18,17.75 R3.1 ; CN1.1 v1(18.4,4.65)
  Bottom Layer w0.508: v1(18.4,4.65) 18.4,12.35 17.12,13.62 17.12,15.88 15.87,17.14 v1(14.44,17.14)
$1N622: length 4
  Top Layer w0.508: R1.1 R5.1 12.14,15.25 12.79,14.59 U1.8
$1N626: length 2.7
  Top Layer w0.508: R4.2 12.2,19 12.79,18.41 U1.5

## Copper pours and planes (outline as drawn; the poured copper is in the pictures)
GND on Top Layer: 33,16.9 32.96,17.71 32.88,18.52 32.76,19.32 32.6,20.12 32.4,20.9 32.17,21.68 31.89,22.44 31.58,23.19 31.24,23.92 30.86,24.63 30.44,25.33 29.99,26 29.51,26.65 28.99,27.28 28.45,27.88 27.88,28.45 27.28,28.99 26.65,29.51 26,29.99 25.33,30.44 24.63,30.86 23.92,31.24 23.19,31.58 22.44,31.89 21.68,32.17 20.9,32.4 20.12,32.6 19.32,32.76 18.52,32.88 17.71,32.96 16.9,33 16.1,33 15.29,32.96 14.48,32.88 13.68,32.76 12.88,32.6 12.1,32.4 11.32,32.17 10.56,31.89 9.81,31.58 9.08,31.24 8.37,30.86 7.67,30.44 7,29.99 6.35,29.51 5.72,28.99 5.12,28.45 4.55,27.88 4.01,27.28 3.49,26.65 3.01,26 2.56,25.33 2.14,24.63 1.76,23.92 1.42,23.19 1.11,22.44 0.83,21.68 0.6,20.9 0.4,20.12 0.24,19.32 0.12,18.52 0.04,17.71 0,16.9 0,16.1 0.04,15.29 0.12,14.48 0.24,13.68 0.4,12.88 0.6,12.1 0.83,11.32 1.11,10.56 1.42,9.81 1.76,9.08 2.14,8.37 2.56,7.67 3.01,7 3.49,6.35 4.01,5.72 4.55,5.12 5.12,4.55 5.72,4.01 6.35,3.49 7,3.01 7.67,2.56 8.37,2.14 9.08,1.76 9.81,1.42 10.56,1.11 11.32,0.83 12.1,0.6 12.88,0.4 13.68,0.24 14.48,0.12 15.29,0.04 16.1,0 16.9,0 17.71,0.04 18.52,0.12 19.32,0.24 20.12,0.4 20.9,0.6 21.68,0.83 22.44,1.11 23.19,1.42 23.92,1.76 24.63,2.14 25.33,2.56 26,3.01 26.65,3.49 27.28,4.01 27.88,4.55 28.45,5.12 28.99,5.72 29.51,6.35 29.99,7 30.44,7.67 30.86,8.37 31.24,9.08 31.58,9.81 31.89,10.56 32.17,11.32 32.4,12.1 32.6,12.88 32.76,13.68 32.88,14.48 32.96,15.29 33,16.1
GND on Bottom Layer: 33,16.9 32.96,17.71 32.88,18.52 32.76,19.32 32.6,20.12 32.4,20.9 32.17,21.68 31.89,22.44 31.58,23.19 31.24,23.92 30.86,24.63 30.44,25.33 29.99,26 29.51,26.65 28.99,27.28 28.45,27.88 27.88,28.45 27.28,28.99 26.65,29.51 26,29.99 25.33,30.44 24.63,30.86 23.92,31.24 23.19,31.58 22.44,31.89 21.68,32.17 20.9,32.4 20.12,32.6 19.32,32.76 18.52,32.88 17.71,32.96 16.9,33 16.1,33 15.29,32.96 14.48,32.88 13.68,32.76 12.88,32.6 12.1,32.4 11.32,32.17 10.56,31.89 9.81,31.58 9.08,31.24 8.37,30.86 7.67,30.44 7,29.99 6.35,29.51 5.72,28.99 5.12,28.45 4.55,27.88 4.01,27.28 3.49,26.65 3.01,26 2.56,25.33 2.14,24.63 1.76,23.92 1.42,23.19 1.11,22.44 0.83,21.68 0.6,20.9 0.4,20.12 0.24,19.32 0.12,18.52 0.04,17.71 0,16.9 0,16.1 0.04,15.29 0.12,14.48 0.24,13.68 0.4,12.88 0.6,12.1 0.83,11.32 1.11,10.56 1.42,9.81 1.76,9.08 2.14,8.37 2.56,7.67 3.01,7 3.49,6.35 4.01,5.72 4.55,5.12 5.12,4.55 5.72,4.01 6.35,3.49 7,3.01 7.67,2.56 8.37,2.14 9.08,1.76 9.81,1.42 10.56,1.11 11.32,0.83 12.1,0.6 12.88,0.4 13.68,0.24 14.48,0.12 15.29,0.04 16.1,0 16.9,0 17.71,0.04 18.52,0.12 19.32,0.24 20.12,0.4 20.9,0.6 21.68,0.83 22.44,1.11 23.19,1.42 23.92,1.76 24.63,2.14 25.33,2.56 26,3.01 26.65,3.49 27.28,4.01 27.88,4.55 28.45,5.12 28.99,5.72 29.51,6.35 29.99,7 30.44,7.67 30.86,8.37 31.24,9.08 31.58,9.81 31.89,10.56 32.17,11.32 32.4,12.1 32.6,12.88 32.76,13.68 32.88,14.48 32.96,15.29 33,16.1

## Text on the board
Bottom Silkscreen Layer: VDD | PHW | GND | PHV | SCL | SDA
Top Silkscreen Layer: JLCJLCJLCJLC
